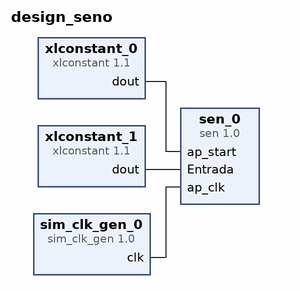
[diagram p0: block diagram of the top level]
# Vivado block design design_seno, xc7z020clg484-1, Vivado 2018.3
create_bd_design design_seno

create_bd_cell -type ip -vlnv xilinx.com:user:sen:1.0 sen_0
create_bd_cell -type ip -vlnv xilinx.com:ip:xlconstant:1.1 xlconstant_0
create_bd_cell -type ip -vlnv xilinx.com:ip:xlconstant:1.1 xlconstant_1
set_property -dict {CONFIG.CONST_VAL 20 CONFIG.CONST_WIDTH 32} [get_bd_cells xlconstant_1]
create_bd_cell -type ip -vlnv xilinx.com:ip:sim_clk_gen:1.0 sim_clk_gen_0

# ---- connections ----

connect_bd_net [get_bd_pins xlconstant_0/dout] [get_bd_pins sen_0/ap_start]
connect_bd_net [get_bd_pins xlconstant_1/dout] [get_bd_pins sen_0/Entrada]
connect_bd_net [get_bd_pins sim_clk_gen_0/clk] [get_bd_pins sen_0/ap_clk]

validate_bd_design
save_bd_design
